# Altium project adio.PRJPCB
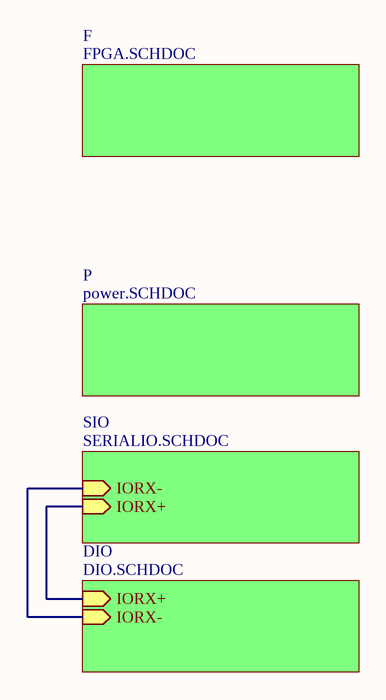
[diagram p0: main.SCHDOC]
6 sheets, 163 parts. Net scope: hierarchical (ports join the sheet entries above them; power ports are global).
Board file: adio.PCBDOC
Sheets:
  main.SCHDOC
    F = FPGA.SCHDOC
      A1 = ADIO.SCHDOC
      A2 = ADIO.SCHDOC
    P = power.SCHDOC
    SIO = SERIALIO.SCHDOC
    DIO = DIO.SCHDOC

## Sheet main.SCHDOC
size A

### Sub-sheets
DIO = DIO.SCHDOC: IORX+ (in), IORX- (in)
F = FPGA.SCHDOC: no entries
P = power.SCHDOC: no entries
SIO = SERIALIO.SCHDOC: IORX- (in), IORX+ (in)

### Nets
IORX+: sheet SIO/IORX+, sheet DIO/IORX+
IORX-: sheet SIO/IORX-, sheet DIO/IORX-

## Sheet FPGA.SCHDOC
size B
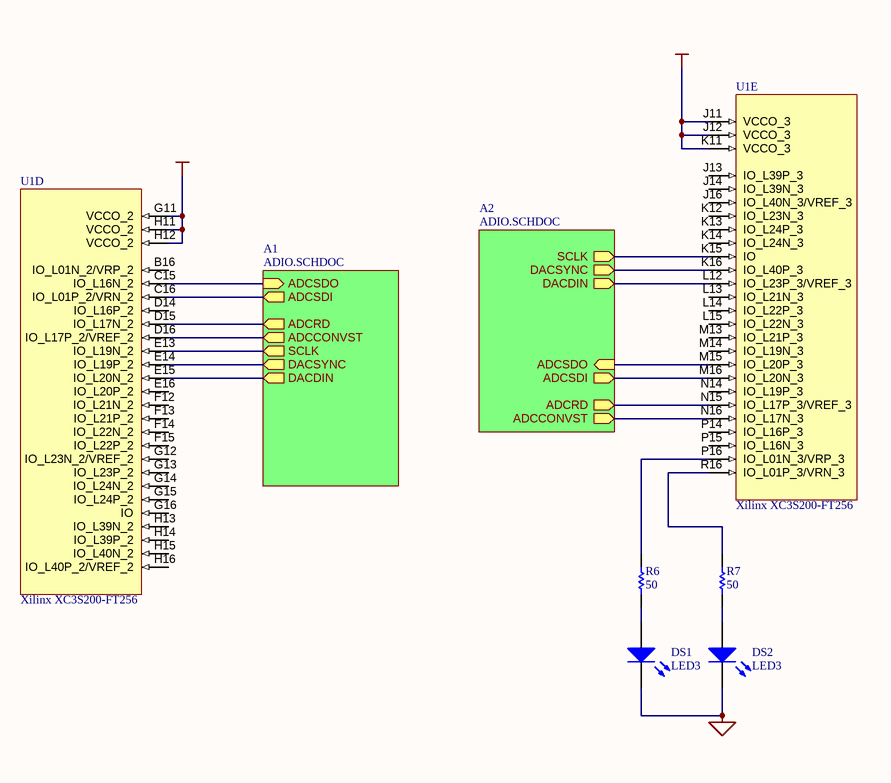
[diagram p1: FPGA.SCHDOC]

### Parts
DS1  LED3  [SMD _LED]
DS2  LED3  [SMD _LED]
R6  value 50  [0603]  (hidden comment: current-limiting series res)
R7  value 50  [0603]  (hidden comment: current-limiting series res)
U1  Xilinx XC3S200-FT256  [Xilinx FT256 BGA]  (parts D,E of 9)

### Sub-sheets
A1 = ADIO.SCHDOC: ADCCONVST (out), SCLK (out), DACSYNC (out), DACDIN (out), ADCSDO (in), ADCSDI (out), ADCRD (out)
A2 = ADIO.SCHDOC: ADCCONVST (out), SCLK (out), DACSYNC (out), DACDIN (out), ADCSDO (in), ADCSDI (out), ADCRD (out)

### Nets
GND: DS1.2(K) DS2.2(K)
VCC: U1.G11(VCCO_2) U1.H11(VCCO_2) U1.H12(VCCO_2) U1.J11(VCCO_3) U1.J12(VCCO_3) U1.K11(VCCO_3)
NetDS1_1: DS1.1(A) R6.2
NetDS2_1: DS2.1(A) R7.2
NetR6_1: R6.1 U1.P16(IO_L01N_3/VRP_3)
NetR7_1: R7.1 U1.R16(IO_L01P_3/VRN_3)
NetU1_C15: U1.C15(IO_L16N_2) ; sheet A1/ADCSDO
NetU1_C16: U1.C16(IO_L01P_2/VRN_2) ; sheet A1/ADCSDI
NetU1_D15: U1.D15(IO_L17N_2) ; sheet A1/ADCRD
NetU1_D16: U1.D16(IO_L17P_2/VREF_2) ; sheet A1/ADCCONVST
NetU1_E13: U1.E13(IO_L19N_2) ; sheet A1/SCLK
NetU1_E14: U1.E14(IO_L19P_2) ; sheet A1/DACSYNC
NetU1_E15: U1.E15(IO_L20N_2) ; sheet A1/DACDIN
NetU1_K15: U1.K15(IO) ; sheet A2/SCLK
NetU1_K16: U1.K16(IO_L40P_3) ; sheet A2/DACSYNC
NetU1_L12: U1.L12(IO_L23P_3/VREF_3) ; sheet A2/DACDIN
NetU1_M15: U1.M15(IO_L20P_3) ; sheet A2/ADCSDO
NetU1_M16: U1.M16(IO_L20N_3) ; sheet A2/ADCSDI
NetU1_N15: U1.N15(IO_L17P_3/VREF_3) ; sheet A2/ADCRD
NetU1_N16: U1.N16(IO_L17N_3) ; sheet A2/ADCCONVST

Not connected (* = marked no-connect by the designer): U1 B16(IO_L01N_2/VRP_2) D14(IO_L16P_2) E16(IO_L20P_2) F12(IO_L21N_2) F13(IO_L21P_2) F14(IO_L22N_2) F15(IO_L22P_2) G12(IO_L23N_2/VREF_2) G13(IO_L23P_2) G14(IO_L24N_2) G15(IO_L24P_2) G16(IO) H13(IO_L39N_2) H14(IO_L39P_2) H15(IO_L40N_2) H16(IO_L40P_2/VREF_2) J13(IO_L39P_3) J14(IO_L39N_3) J16(IO_L40N_3/VREF_3) K12(IO_L23N_3) K13(IO_L24P_3) K14(IO_L24N_3) L13(IO_L21N_3) L14(IO_L22P_3) L15(IO_L22N_3) M13(IO_L21P_3) M14(IO_L19N_3) N14(IO_L19P_3) P14(IO_L16P_3) P15(IO_L16N_3)

### Notes on the sheet
- Title:
- Engineer:
- Date:
- Revision:
- Sheet
- of
- File:

### Library data of the parts
DS1 DS2 = LED3: Typical BLUE SiC LED; Published: 8-Jun-2000; LatestRevisionDate: 17-Dec-2003; LatestRevisionNote: PCB Footprint replaced.; Publisher: Altium Limited
R6 R7 = RESISTOR: Standard Passive Resistor
U1 = XC3S200-FT256: Xilinx Spartan-3 FPGA

## Sheet ADIO.SCHDOC
size B
Used 2 times, as channels F/A1, F/A2. Parts and nets are listed once, with the designators drawn on the sheet.
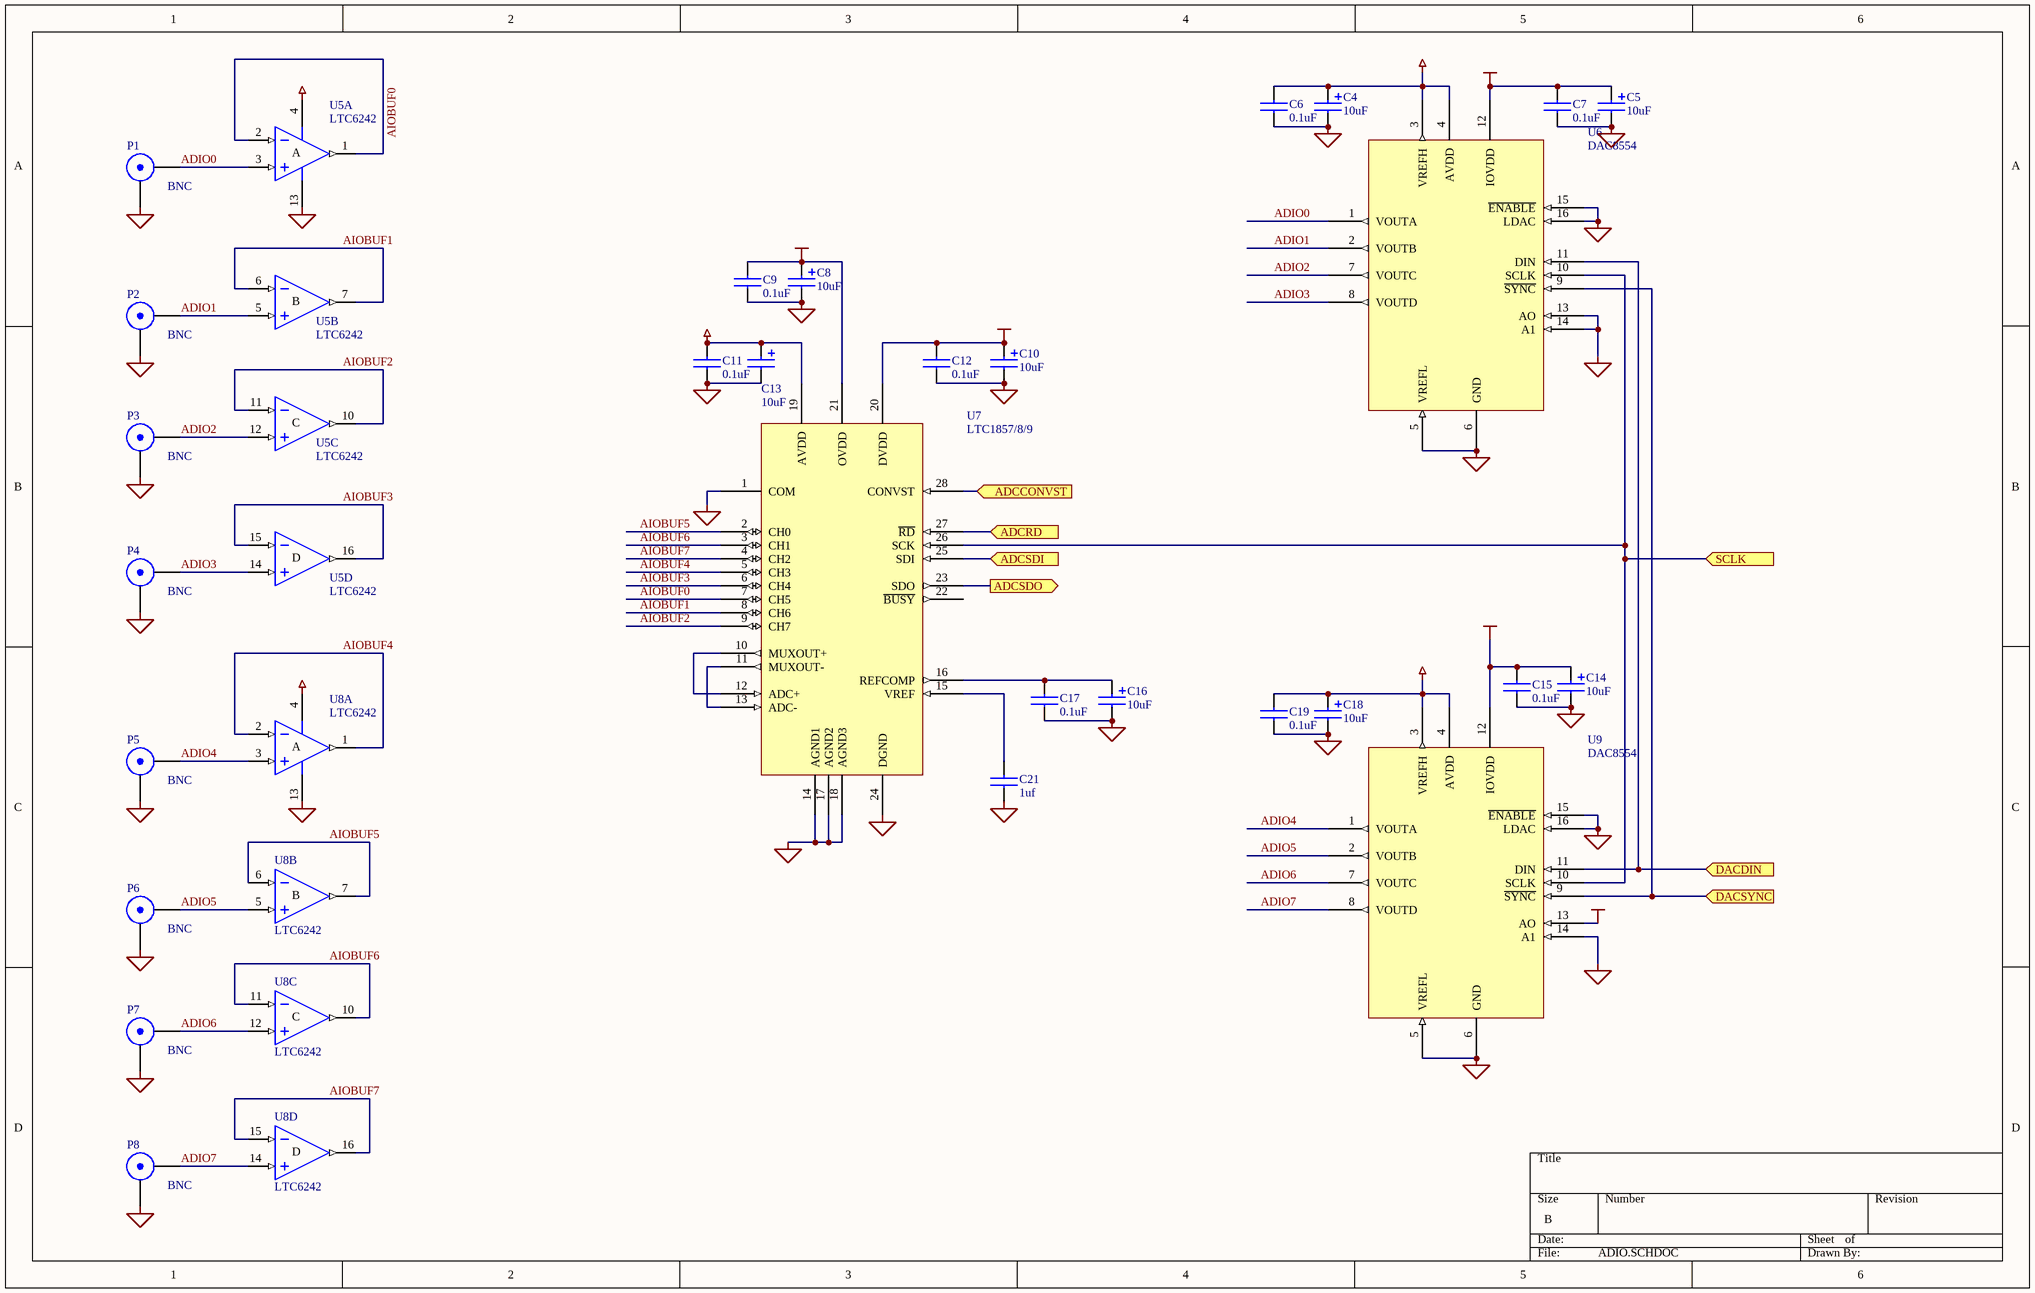
[diagram p2: ADIO.SCHDOC]

### Parts
C4  value 10uF  [3216]  (hidden comment: POLCAP)
C5  value 10uF  [3216]  (hidden comment: POLCAP)
C6  value 0.1uF  [0603]  (hidden comment: CAPACITOR)
C7  value 0.1uF  [0603]  (hidden comment: CAPACITOR)
C8  value 10uF  [3216]  (hidden comment: POLCAP)
C9  value 0.1uF  [0603]  (hidden comment: CAPACITOR)
C10  value 10uF  [3216]  (hidden comment: POLCAP)
C11  value 0.1uF  [0603]  (hidden comment: CAPACITOR)
C12  value 0.1uF  [0603]  (hidden comment: CAPACITOR)
C13  value 10uF  [3216]  (hidden comment: POLCAP)
C14  value 10uF  [3216]  (hidden comment: POLCAP)
C15  value 0.1uF  [0603]  (hidden comment: CAPACITOR)
C16  value 10uF  [3216]  (hidden comment: POLCAP)
C17  value 0.1uF  [0603]  (hidden comment: CAPACITOR)
C18  value 10uF  [3216]  (hidden comment: POLCAP)
C19  value 0.1uF  [0603]  (hidden comment: CAPACITOR)
C21  value 1uf  [0603]  (hidden comment: CAPACITOR)
P1  BNC  [Vertical BNC 227699-1]
P2  BNC  [Vertical BNC 227699-1]
P3  BNC  [Vertical BNC 227699-1]
P4  BNC  [Vertical BNC 227699-1]
P5  BNC  [Vertical BNC 227699-1]
P6  BNC  [Vertical BNC 227699-1]
P7  BNC  [Vertical BNC 227699-1]
P8  BNC  [Vertical BNC 227699-1]
U5  LTC6242  [LTCDHC-16]  (parts A,B,C,D of 4)
U6  DAC8554  [TSSO5x6-G16]
U7  LTC1857/8/9  [LTI_G_TSSOP]
U8  LTC6242  [LTCDHC-16]  (parts A,B,C,D of 4)
U9  DAC8554  [TSSO5x6-G16]

### Ports
ADCCONVST (in), ADCRD (in), ADCSDI (in), ADCSDO (out), DACDIN (in), DACSYNC (in), SCLK (in)

### Nets
+5VCC: C10.1 C12.1 U7.20(DVDD)
AVDD: C4.1 C6.1 C11.1 C13.1 C18.1 C19.1 U5.4(V+) U6.3(VREFH) U6.4(AVDD) U7.19(AVDD) U8.4(V+) U9.3(VREFH) U9.4(AVDD)
GND: C4.2 C5.2 C6.2 C7.2 C8.2 C9.2 C10.2 C11.2 C12.2 C13.2 C14.2 C15.2 C16.2 C17.2 C18.2 C19.2 C21.2 P1.2(Y) P2.2(Y) P3.2(Y) P4.2(Y) P5.2(Y) P6.2(Y) P7.2(Y) P8.2(Y) U5.13(V-) U6.5(VREFL) U6.6(GND) U6.13(AO) U6.14(A1) U6.15(~{ENABLE}) U6.16(LDAC) U7.1(COM) U7.14(AGND1) U7.17(AGND2) U7.18(AGND3) U7.24(DGND) U8.13(V-) U9.5(VREFL) U9.6(GND) U9.14(A1) U9.15(~{ENABLE}) U9.16(LDAC)
VCC: C5.1 C7.1 C8.1 C9.1 C14.1 C15.1 U6.12(IOVDD) U7.21(OVDD) U9.12(IOVDD) U9.13(AO)
ADCCONVST: U7.28(CONVST) ; port ADCCONVST
ADCRD: U7.27(~{RD}) ; port ADCRD
ADCSDI: U7.25(SDI) ; port ADCSDI
ADCSDO: U7.23(SDO) ; port ADCSDO
ADIO0: P1.1(X) U5.3(IN+) U6.1(VOUTA)
ADIO1: P2.1(X) U5.5(IN+) U6.2(VOUTB)
ADIO2: P3.1(X) U5.12(IN+) U6.7(VOUTC)
ADIO3: P4.1(X) U5.14(IN+) U6.8(VOUTD)
ADIO4: P5.1(X) U8.3(IN+) U9.1(VOUTA)
ADIO5: P6.1(X) U8.5(IN+) U9.2(VOUTB)
ADIO6: P7.1(X) U8.12(IN+) U9.7(VOUTC)
ADIO7: P8.1(X) U8.14(IN+) U9.8(VOUTD)
AIOBUF0: U5.1(OUT) U5.2(IN-) U7.7(CH5)
AIOBUF1: U5.6(IN-) U5.7(OUT) U7.8(CH6)
AIOBUF2: U5.10(OUT) U5.11(IN-) U7.9(CH7)
AIOBUF3: U5.15(IN-) U5.16(OUT) U7.6(CH4)
AIOBUF4: U7.5(CH3) U8.1(OUT) U8.2(IN-)
AIOBUF5: U7.2(CH0) U8.6(IN-) U8.7(OUT)
AIOBUF6: U7.3(CH1) U8.10(OUT) U8.11(IN-)
AIOBUF7: U7.4(CH2) U8.15(IN-) U8.16(OUT)
DACDIN: U6.11(DIN) U9.11(DIN) ; port DACDIN
DACSYNC: U6.9(~{SYNC}) U9.9(~{SYNC}) ; port DACSYNC
SCLK: U6.10(SCLK) U7.26(SCK) U9.10(SCLK) ; port SCLK
NetC16_1: C16.1 C17.1 U7.16(REFCOMP)
NetC21_1: C21.1 U7.15(VREF)
NetU7_10: U7.10(MUXOUT+) U7.12(ADC+)
NetU7_11: U7.11(MUXOUT-) U7.13(ADC-)

Not connected (* = marked no-connect by the designer): U7 22(~{BUSY})

### Channels
F/A1: designators end in .A1; ports ADCCONVST=NetU1_D16 ADCRD=NetU1_D15 ADCSDI=NetU1_C16 ADCSDO=NetU1_C15 DACDIN=NetU1_E15 DACSYNC=NetU1_E14 SCLK=NetU1_E13
F/A2: designators end in .A2; ports ADCCONVST=NetU1_N16 ADCRD=NetU1_N15 ADCSDI=NetU1_M16 ADCSDO=NetU1_M15 DACDIN=NetU1_L12 DACSYNC=NetU1_K16 SCLK=NetU1_K15

### Notes on the sheet
- (in symbol LTC6242, part A) A
- (in symbol LTC6242, part B) B
- (in symbol LTC6242, part C) C
- (in symbol LTC6242, part D) D

### Library data of the parts
C4 C5 C8 C10 C13 C14 C16 C18 = POLCAP: Standard Capacitor; Type: Tantalum
C6 C7 C9 C11 C12 C15 C17 C19 C21 = CAPACITOR: Standard Capacitor; Type: X7R
P1-P8 = BNC: BNC Elbow Connector; Manufacturer: Generic Components; Class II: RF Coaxial; Revision: July-2002: Re-released for DXP Platform.; Publisher: Altium Limited; Class I: Connector
U5 U8 = LTC6242: Quad 18 Mhz, Low Noise, Rail-to-Rail CMOS Op-Amp; Published: 8-Jun-2000; LatestRevisionDate: 6-Jun-2005; DatasheetDocument: 1996; Publisher: Altium Limited
U6 U9 = DAC8554: TI 16-bit quad chan Voltage Output DAC
U7 = LTC1859: LTC 8-channel 12, 14, 16 100ksps ADC

## Sheet power.SCHDOC
size B
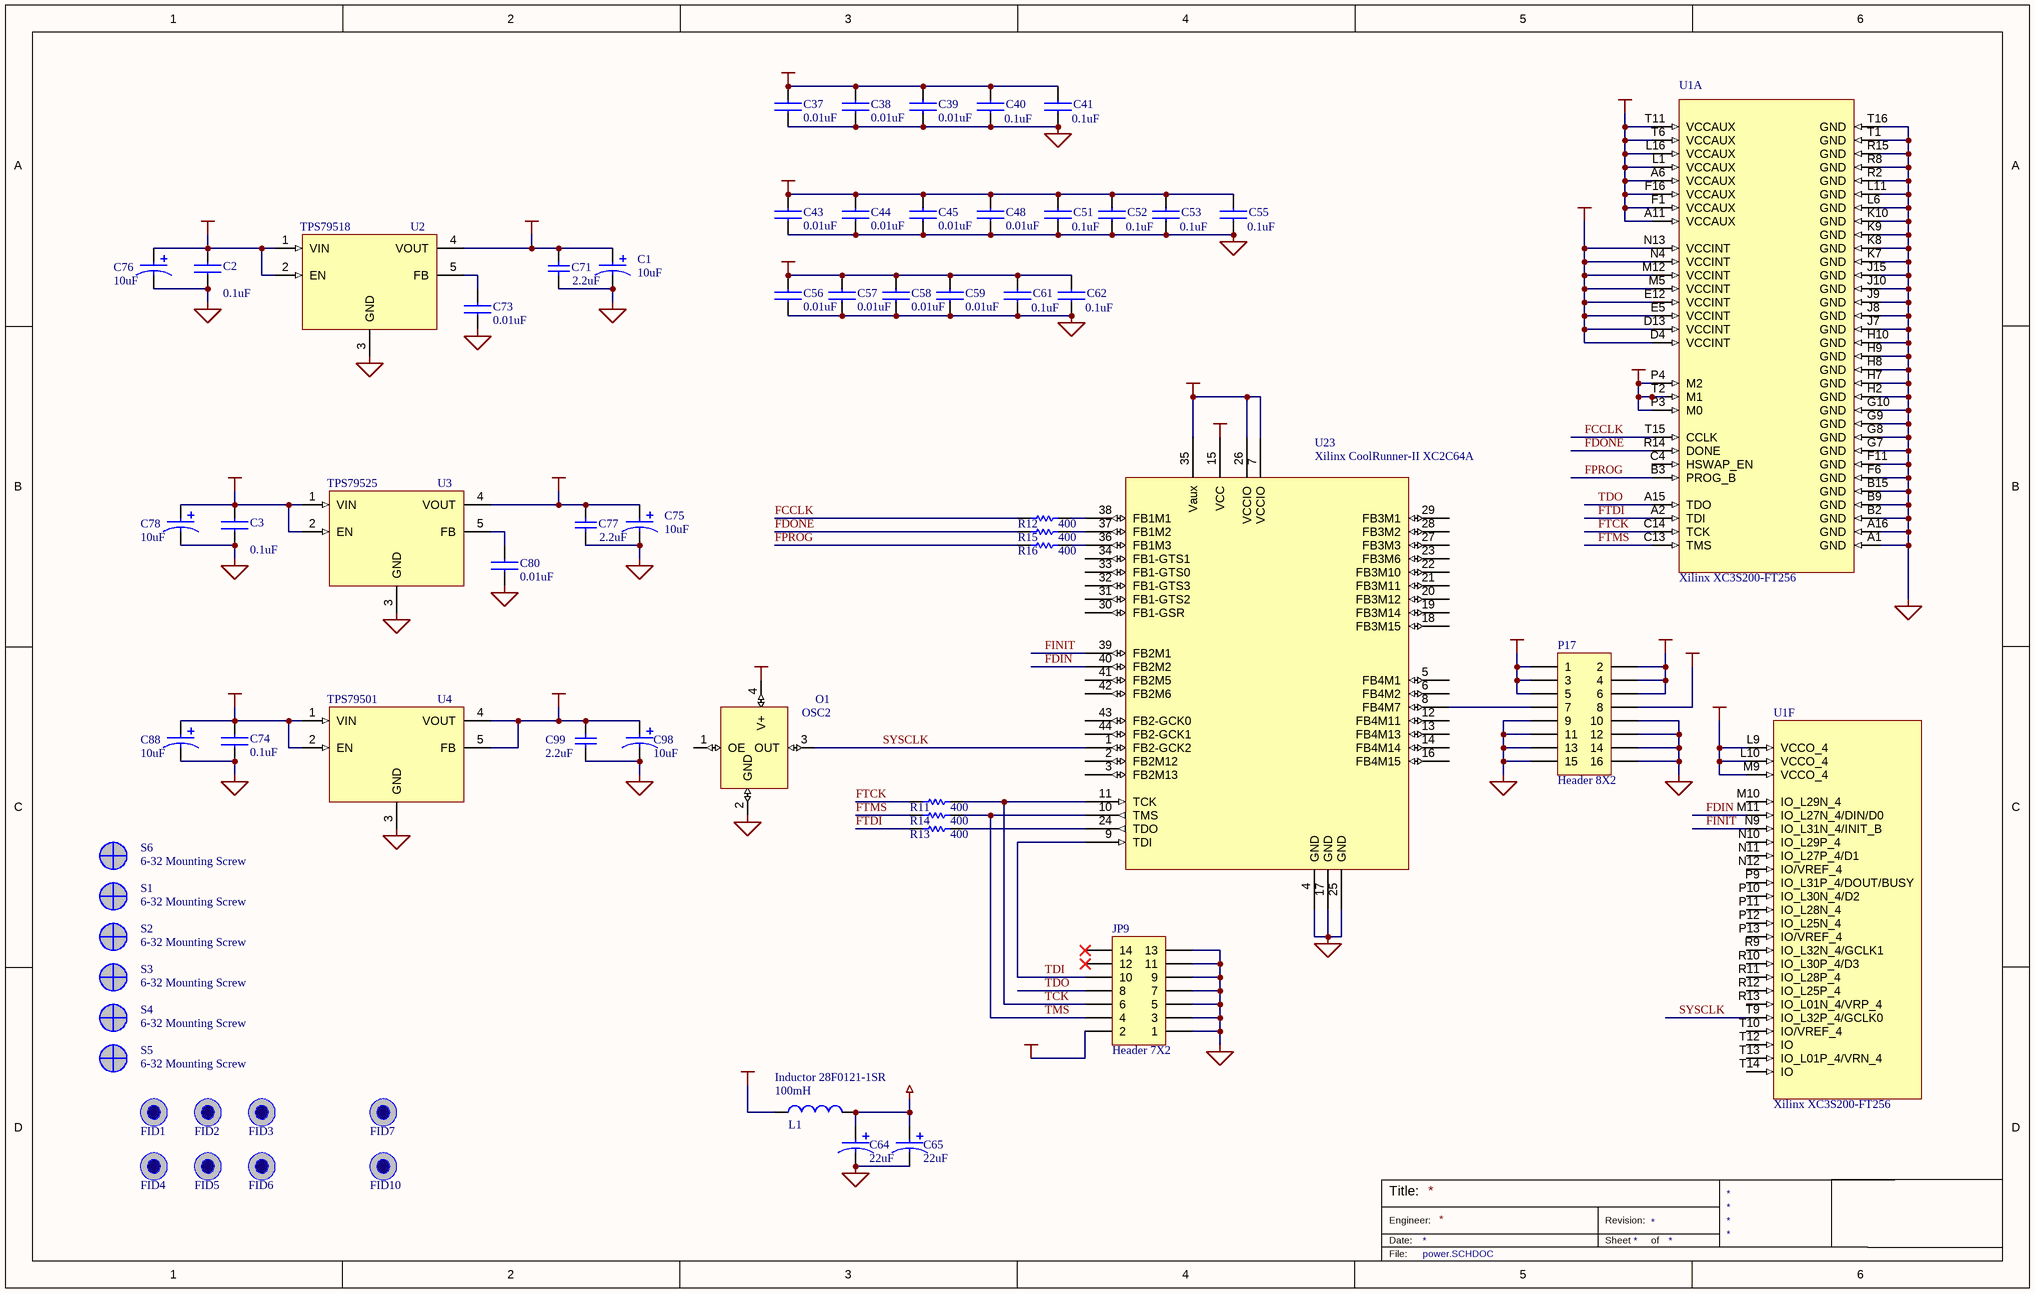
[diagram p3: power.SCHDOC]

### Parts
C1  value 10uF  [6032]  (hidden comment: POLCAP2)
C2  value 0.1uF  [0603]  (hidden comment: CAPACITOR)
C3  value 0.1uF  [0603]  (hidden comment: CAPACITOR)
C37  value 0.01uF  [0402]  (hidden comment: CAPACITOR)
C38  value 0.01uF  [0402]  (hidden comment: CAPACITOR)
C39  value 0.01uF  [0402]  (hidden comment: CAPACITOR)
C40  value 0.1uF  [0603]  (hidden comment: CAPACITOR)
C41  value 0.1uF  [0603]  (hidden comment: CAPACITOR)
C43  value 0.01uF  [0402]  (hidden comment: CAPACITOR)
C44  value 0.01uF  [0402]  (hidden comment: CAPACITOR)
C45  value 0.01uF  [0402]  (hidden comment: CAPACITOR)
C48  value 0.01uF  [0402]  (hidden comment: CAPACITOR)
C51  value 0.1uF  [0603]  (hidden comment: CAPACITOR)
C52  value 0.1uF  [0603]  (hidden comment: CAPACITOR)
C53  value 0.1uF  [0603]  (hidden comment: CAPACITOR)
C55  value 0.1uF  [0603]  (hidden comment: CAPACITOR)
C56  value 0.01uF  [0402]  (hidden comment: CAPACITOR)
C57  value 0.01uF  [0402]  (hidden comment: CAPACITOR)
C58  value 0.01uF  [0402]  (hidden comment: CAPACITOR)
C59  value 0.01uF  [0402]  (hidden comment: CAPACITOR)
C61  value 0.1uF  [0603]  (hidden comment: CAPACITOR)
C62  value 0.1uF  [0603]  (hidden comment: CAPACITOR)
C64  value 22uF  [6032]  (hidden comment: POLCAP2)
C65  value 22uF  [6032]  (hidden comment: POLCAP2)
C71  value 2.2uF  [1206]  (hidden comment: Cap)
C73  value 0.01uF  [0402]  (hidden comment: CAPACITOR)
C74  value 0.1uF  [0603]  (hidden comment: CAPACITOR)
C75  value 10uF  [6032]  (hidden comment: POLCAP2)
C76  value 10uF  [6032]  (hidden comment: POLCAP2)
C77  value 2.2uF  [1206]  (hidden comment: Cap)
C78  value 10uF  [6032]  (hidden comment: POLCAP2)
C80  value 0.01uF  [0402]  (hidden comment: CAPACITOR)
C88  value 10uF  [6032]  (hidden comment: POLCAP2)
C98  value 10uF  [6032]  (hidden comment: POLCAP2)
C99  value 2.2uF  [1206]  (hidden comment: Cap)
FID1  FIDUCIAL  [FIDUCIAL]  (value not drawn)
FID2  FIDUCIAL  [FIDUCIAL]  (value not drawn)
FID3  FIDUCIAL  [FIDUCIAL]  (value not drawn)
FID4  FIDUCIAL  [FIDUCIAL]  (value not drawn)
FID5  FIDUCIAL  [FIDUCIAL]  (value not drawn)
FID6  FIDUCIAL  [FIDUCIAL]  (value not drawn)
FID7  FIDUCIAL  [FIDUCIAL]  (value not drawn)
FID10  FIDUCIAL  [FIDUCIAL]  (value not drawn)
JP9  Header 7X2  [SMT 2x7 2mm HDR]
L1  Inductor 28F0121-1SR  value 100mH  [STEWARD_1SR]
O1  OSC2  [ECS-3953M]
P17  Header 8X2  [MOLEX 15-91-2160]
R11  value 400  [0603]  (hidden comment: current-limiting series res)
R12  value 400  [0603]  (hidden comment: current-limiting series res)
R13  value 400  [0603]  (hidden comment: current-limiting series res)
R14  value 400  [0603]  (hidden comment: current-limiting series res)
R15  value 400  [0603]  (hidden comment: current-limiting series res)
R16  value 400  [0603]  (hidden comment: current-limiting series res)
S1  6-32 Mounting Screw  [SCREW6-32]
S2  6-32 Mounting Screw  [SCREW6-32]
S3  6-32 Mounting Screw  [SCREW6-32]
S4  6-32 Mounting Screw  [SCREW6-32]
S5  6-32 Mounting Screw  [SCREW6-32]
S6  6-32 Mounting Screw  [SCREW6-32]
U1  Xilinx XC3S200-FT256  [Xilinx FT256 BGA]  (parts A,F of 9)
U2  TPS79518  [SOT223-5/Simple]
U3  TPS79525  [SOT223-5/Simple]
U4  TPS79501  [SOT223-5/Simple]
U23  Xilinx CoolRunner-II XC2C64A  [QFP10x10-G44/G10N]

### Nets
+1.2VCC: C37.1 C38.1 C39.1 C40.1 C41.1 C98.1 C99.2 U1.D4(VCCINT) U1.D13(VCCINT) U1.E5(VCCINT) U1.E12(VCCINT) U1.M5(VCCINT) U1.M12(VCCINT) U1.N4(VCCINT) U1.N13(VCCINT) U4.4(VOUT) U4.5(FB)
+1.8VCC: C1.1 C71.2 U2.4(VOUT) U23.15(VCC)
+2.5VCC: C43.1 C44.1 C45.1 C48.1 C51.1 C52.1 C53.1 C55.1 C75.1 C77.2 U1.A6(VCCAUX) U1.A11(VCCAUX) U1.F1(VCCAUX) U1.F16(VCCAUX) U1.L1(VCCAUX) U1.L16(VCCAUX) U1.T6(VCCAUX) U1.T11(VCCAUX) U3.4(VOUT)
+5VCC: L1.1 P17.2 P17.4 P17.6
+12VCC: P17.8
AVDD: C64.1 C65.1 L1.2
GND: C1.2 C2.1 C3.1 C37.2 C38.2 C39.2 C40.2 C41.2 C43.2 C44.2 C45.2 C48.2 C51.2 C52.2 C53.2 C55.2 C56.2 C57.2 C58.2 C59.2 C61.2 C62.2 C64.2 C65.2 C71.1 C73.1 C74.1 C75.2 C76.2 C77.1 C78.2 C80.1 C88.2 C98.2 C99.1 JP9.1 JP9.3 JP9.5 JP9.7 JP9.9 JP9.11 JP9.13 O1.2(GND) P17.9 P17.10 P17.11 P17.12 P17.13 P17.14 P17.15 P17.16 U1.A1(GND) U1.A16(GND) U1.B2(GND) U1.B9(GND) U1.B15(GND) U1.F6(GND) U1.F11(GND) U1.G7(GND) U1.G8(GND) U1.G9(GND) U1.G10(GND) U1.H2(GND) U1.H7(GND) U1.H8(GND) U1.H9(GND) U1.H10(GND) U1.J7(GND) U1.J8(GND) U1.J9(GND) U1.J10(GND) U1.J15(GND) U1.K7(GND) U1.K8(GND) U1.K9(GND) U1.K10(GND) U1.L6(GND) U1.L11(GND) U1.R2(GND) U1.R8(GND) U1.R15(GND) U1.T1(GND) U1.T16(GND) U2.3(GND) U3.3(GND) U4.3(GND) U23.4(GND) U23.17(GND) U23.25(GND)
VCC: C2.2 C3.2 C56.1 C57.1 C58.1 C59.1 C61.1 C62.1 C74.2 C76.1 C78.1 C88.1 JP9.2 O1.4(V+) P17.1 P17.3 P17.5 U1.L9(VCCO_4) U1.L10(VCCO_4) U1.M9(VCCO_4) U1.P3(M0) U1.P4(M2) U1.T2(M1) U2.1(VIN) U2.2(EN) U3.1(VIN) U3.2(EN) U4.1(VIN) U4.2(EN) U23.7(VCCIO) U23.26(VCCIO) U23.35(Vaux)
FCCLK: R12.2 U1.T15(CCLK)
FDIN: U1.M11(IO_L27N_4/DIN/D0) U23.40(FB2M2)
FDONE: R15.2 U1.R14(DONE)
FINIT: U1.N9(IO_L31N_4/INIT_B) U23.39(FB2M1)
FPROG: R16.2 U1.B3(PROG_B)
FTCK: R11.2 U1.C14(TCK)
FTDI: R13.2 U1.A2(TDI)
FTMS: R14.1 U1.C13(TMS)
SYSCLK: O1.3(OUT) U1.T9(IO_L32P_4/GCLK0) U23.1(FB2-GCK2)
TCK: JP9.6 R11.1 U23.11(TCK)
TDI: JP9.10 U23.9(TDI)
TDO: JP9.8 U1.A15(TDO)
TMS: JP9.4 R14.2 U23.10(TMS)
NetC73_2: C73.2 U2.5(FB)
NetC80_2: C80.2 U3.5(FB)
NetP17_7: P17.7 U23.8(FB4M7)
NetR12_1: R12.1 U23.38(FB1M1)
NetR13_1: R13.1 U23.24(TDO)
NetR15_1: R15.1 U23.37(FB1M2)
NetR16_1: R16.1 U23.36(FB1M3)

Not connected (* = marked no-connect by the designer): JP9 12* 14*; O1 1(OE); U1 C4(HSWAP_EN) M10(IO_L29N_4) N10(IO_L29P_4) N11(IO_L27P_4/D1) N12(IO/VREF_4) P9(IO_L31P_4/DOUT/BUSY) P10(IO_L30N_4/D2) P11(IO_L28N_4) P12(IO_L25N_4) P13(IO/VREF_4) R9(IO_L32N_4/GCLK1) R10(IO_L30P_4/D3) R11(IO_L28P_4) R12(IO_L25P_4) R13(IO_L01N_4/VRP_4) T10(IO/VREF_4) T12(IO) T13(IO_L01P_4/VRN_4) T14(IO); U23 2(FB2M12) 3(FB2M13) 5(FB4M1) 6(FB4M2) 12(FB4M11) 13(FB4M13) 14(FB4M14) 16(FB4M15) 18(FB3M15) 19(FB3M14) 20(FB3M12) 21(FB3M11) 22(FB3M10) 23(FB3M6) 27(FB3M3) 28(FB3M2) 29(FB3M1) 30(FB1-GSR) 31(FB1-GTS2) 32(FB1-GTS3) 33(FB1-GTS0) 34(FB1-GTS1) 41(FB2M5) 42(FB2M6) 43(FB2-GCK0) 44(FB2-GCK1)

### Notes on the sheet
- Title:
- Engineer:
- Date:
- Revision:
- Sheet
- of
- File:

### Library data of the parts
C1 C64 C65 C75 C76 C78 C88 C98 = POLCAP2: Standard Capacitor
C2 C3 C73 C74 C80 = CAPACITOR: Standard Capacitor
C37-C41 C43-C45 C48 C51-C53 C55-C59 C61 C62 = CAPACITOR: Standard Capacitor; Type: X7R
C71 C77 C99 = Cap: Capacitor; Manufacturer: Generic Components; Class I: Passive; Published: 8-Jun-2000; Revision: July-2002: Re-released for DXP Platform.; Publisher: Altium Limited; Class II: Capacitor
JP9 = Header 7X2: Header, 7-Pin, Dual row; Manufacturer: Generic Components; Class I: Connector; Revision: July-2002: Re-released for DXP Platform.; Publisher: Altium Limited
L1 = Inductor: Manufacturer: Generic Components; Class I: Passive; Published: 8-Jun-2000; Revision: July-2002: Re-released for DXP Platform.; Publisher: Altium Limited; Class II: Inductor
O1 = OSC2: ECS SMD Oscillator, ECS-3953M
P17 = Header 8X2: Header, 8-Pin, Dual row; LatestRevisionDate: 17-Jul-2002; LatestRevisionNote: Re-released for DXP Platform.; Publisher: Altium Limited
R11-R16 = RESISTOR: Standard Passive Resistor
S1-S6 = MNTSCREW
U1 = XC3S200-FT256: Xilinx Spartan-3 FPGA
U2-U4 = TPS795XX: TI Ultra-low-noise LDO
U23 = XC2C64A-5VQ44C

## Sheet SERIALIO.SCHDOC
size B
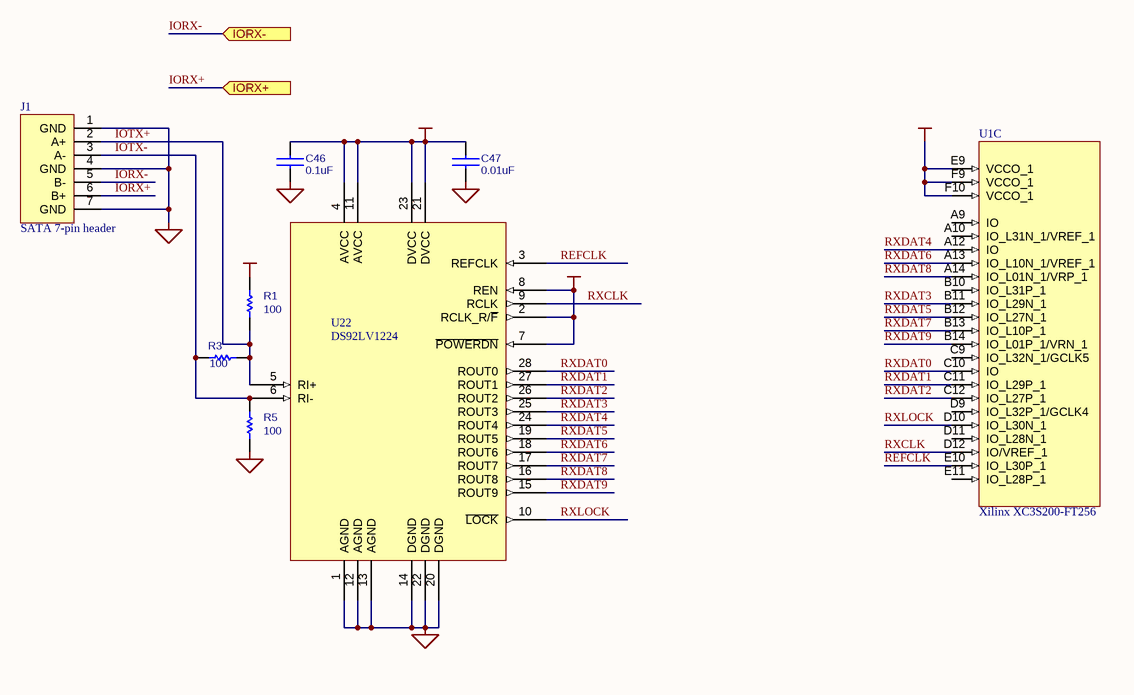
[diagram p4: SERIALIO.SCHDOC]

### Parts
C46  value 0.1uF  [0603]  (hidden comment: CAPACITOR)
C47  value 0.01uF  [0402]  (hidden comment: CAPACITOR)
J1  SATA 7-pin header  [MOLES 67800-5005]
R1  100  [0603]
R3  100  [0603]
R5  100  [0603]
U1  Xilinx XC3S200-FT256  [Xilinx FT256 BGA]  (part C of 9)
U22  DS92LV1224  [SSO-G28/E4.3]

### Ports
IORX+ (in), IORX- (in)

### Nets
GND: C46.1 C47.1 J1.1(GND) J1.4(GND) J1.7(GND) R5.1 U22.1(AGND) U22.12(AGND) U22.13(AGND) U22.14(DGND) U22.20(DGND) U22.22(DGND)
VCC: C46.2 C47.2 R1.1 U1.E9(VCCO_1) U1.F9(VCCO_1) U1.F10(VCCO_1) U22.2(RCLK_R/~{F}) U22.4(AVCC) U22.7(~{POWERDN}) U22.8(REN) U22.11(AVCC) U22.21(DVCC) U22.23(DVCC)
IORX+: J1.6(B+) ; port IORX+
IORX-: J1.5(B-) ; port IORX-
IOTX+: J1.2(A+) R1.2 R3.2 U22.5(RI+)
IOTX-: J1.3(A-) R3.1 R5.2 U22.6(RI-)
REFCLK: U1.E10(IO_L30P_1) U22.3(REFCLK)
RXCLK: U1.D12(IO/VREF_1) U22.9(RCLK)
RXDAT0: U1.C10(IO) U22.28(ROUT0)
RXDAT1: U1.C11(IO_L29P_1) U22.27(ROUT1)
RXDAT2: U1.C12(IO_L27P_1) U22.26(ROUT2)
RXDAT3: U1.B11(IO_L29N_1) U22.25(ROUT3)
RXDAT4: U1.A12(IO) U22.24(ROUT4)
RXDAT5: U1.B12(IO_L27N_1) U22.19(ROUT5)
RXDAT6: U1.A13(IO_L10N_1/VREF_1) U22.18(ROUT6)
RXDAT7: U1.B13(IO_L10P_1) U22.17(ROUT7)
RXDAT8: U1.A14(IO_L01N_1/VRP_1) U22.16(ROUT8)
RXDAT9: U1.B14(IO_L01P_1/VRN_1) U22.15(ROUT9)
RXLOCK: U1.D10(IO_L30N_1) U22.10(~{LOCK})

Not connected (* = marked no-connect by the designer): U1 A9(IO) A10(IO_L31N_1/VREF_1) B10(IO_L31P_1) C9(IO_L32N_1/GCLK5) D9(IO_L32P_1/GCLK4) D11(IO_L28N_1) E11(IO_L28P_1)

### Notes on the sheet
- Title:
- Engineer:
- Date:
- Revision:
- Sheet
- of
- File:

### Library data of the parts
C46 C47 = CAPACITOR: Standard Capacitor
J1 = SATA-7
R1 R3 R5 = RESISTOR: Standard Passive Resistor; Value: 100
U1 = XC3S200-FT256: Xilinx Spartan-3 FPGA
U22 = DS92LV1224: 30-66 MHz 10-Bit Bus LVDS Deserializer

## Sheet DIO.SCHDOC
size B
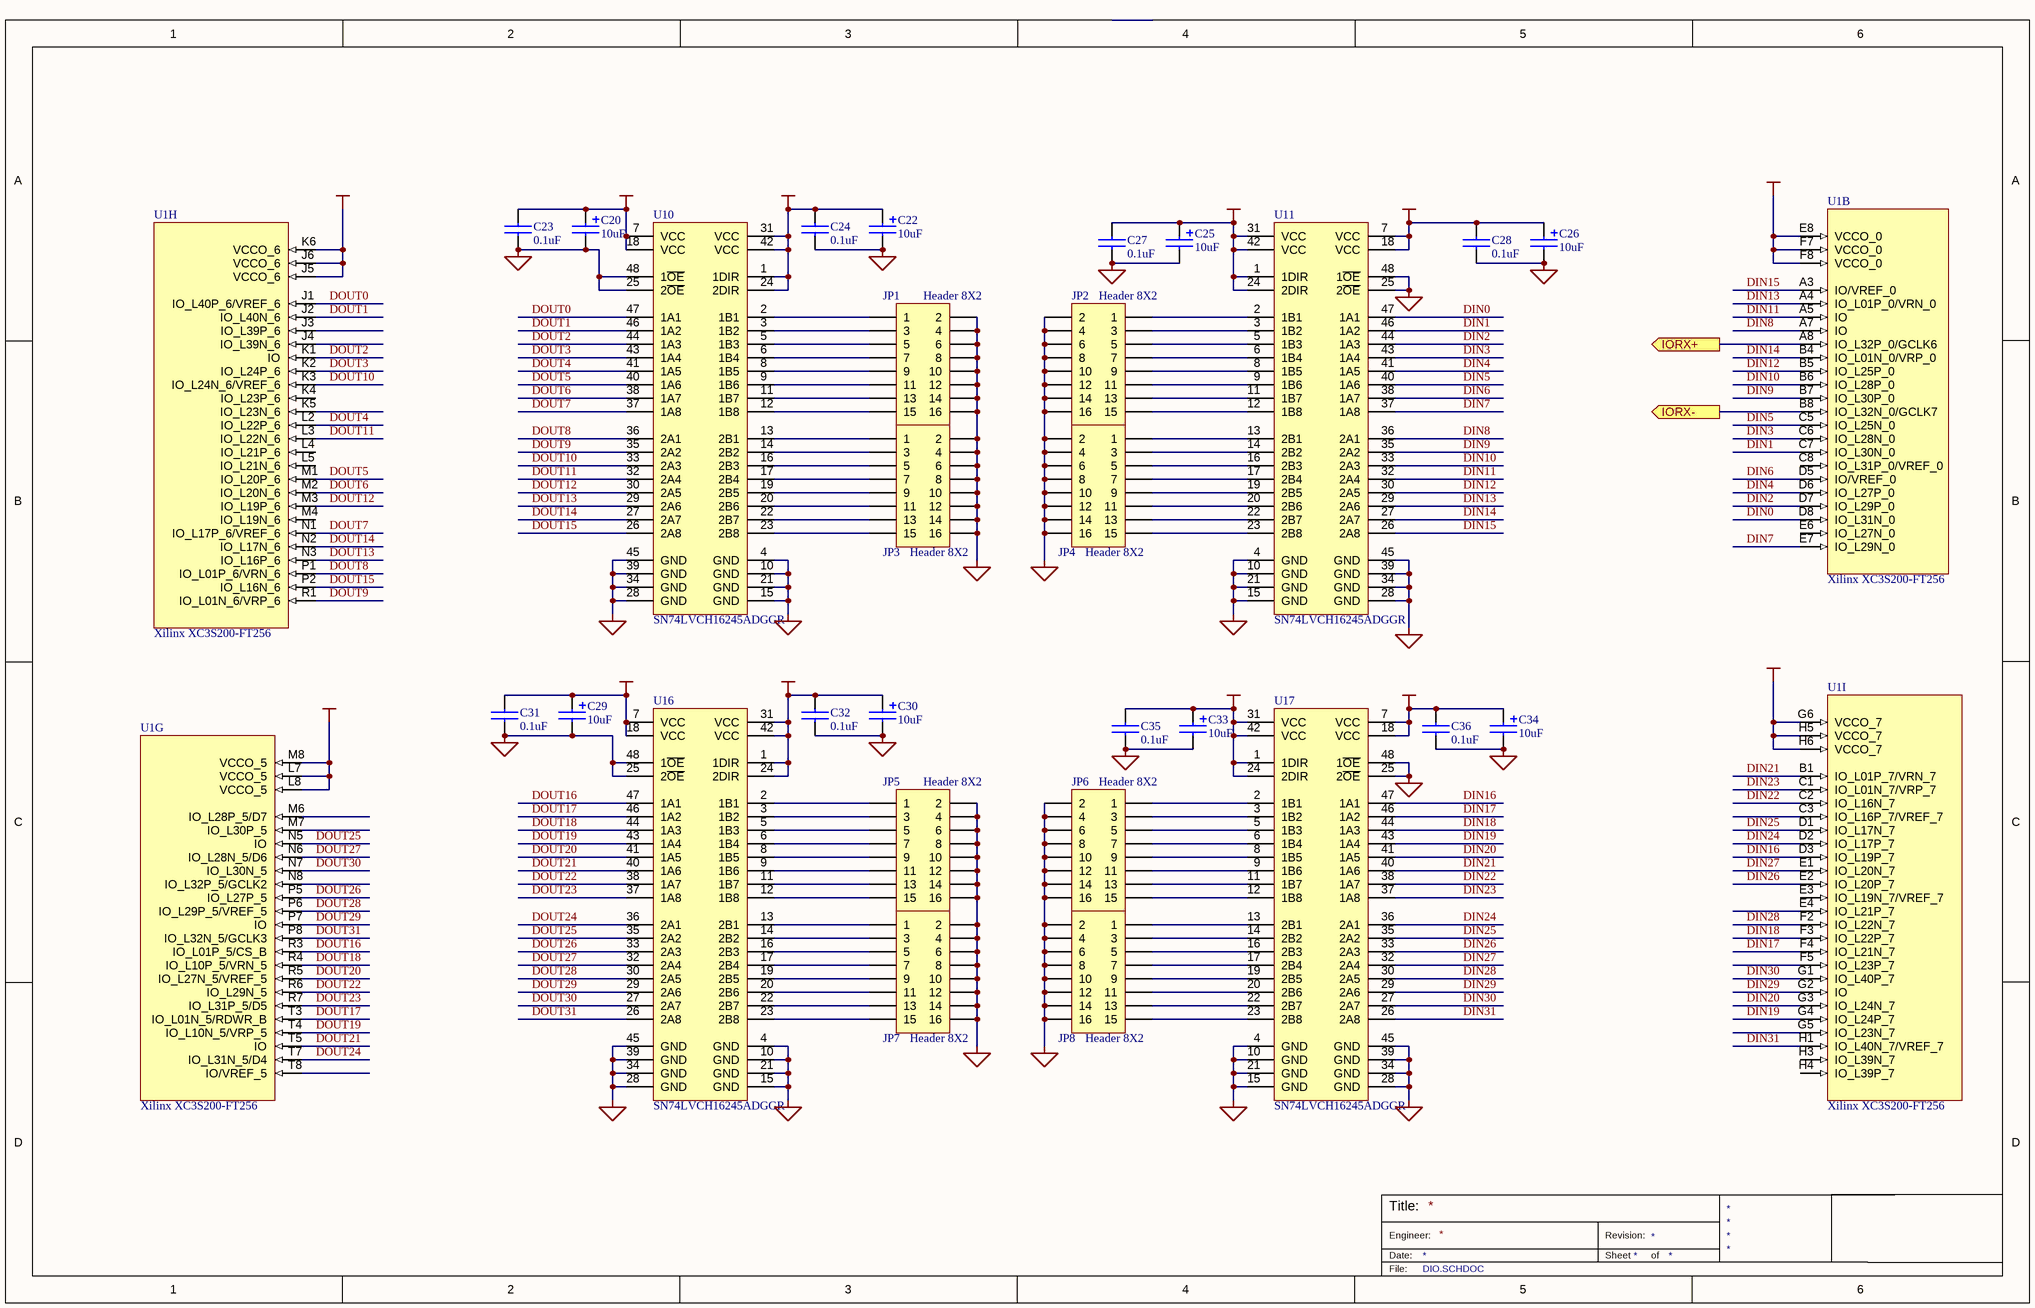
[diagram p5: DIO.SCHDOC]

### Parts
C20  value 10uF  [3216]  (hidden comment: POLCAP)
C22  value 10uF  [3216]  (hidden comment: POLCAP)
C23  value 0.1uF  [0603]  (hidden comment: CAPACITOR)
C24  value 0.1uF  [0603]  (hidden comment: CAPACITOR)
C25  value 10uF  [3216]  (hidden comment: POLCAP)
C26  value 10uF  [3216]  (hidden comment: POLCAP)
C27  value 0.1uF  [0603]  (hidden comment: CAPACITOR)
C28  value 0.1uF  [0603]  (hidden comment: CAPACITOR)
C29  value 10uF  [3216]  (hidden comment: POLCAP)
C30  value 10uF  [3216]  (hidden comment: POLCAP)
C31  value 0.1uF  [0603]  (hidden comment: CAPACITOR)
C32  value 0.1uF  [0603]  (hidden comment: CAPACITOR)
C33  value 10uF  [3216]  (hidden comment: POLCAP)
C34  value 10uF  [3216]  (hidden comment: POLCAP)
C35  value 0.1uF  [0603]  (hidden comment: CAPACITOR)
C36  value 0.1uF  [0603]  (hidden comment: CAPACITOR)
JP1  Header 8X2  [HDR2X8]
JP2  Header 8X2  [HDR2X8]
JP3  Header 8X2  [HDR2X8]
JP4  Header 8X2  [HDR2X8]
JP5  Header 8X2  [HDR2X8]
JP6  Header 8X2  [HDR2X8]
JP7  Header 8X2  [HDR2X8]
JP8  Header 8X2  [HDR2X8]
U1  Xilinx XC3S200-FT256  [Xilinx FT256 BGA]  (parts B,G,H,I of 9)
U10  SN74LVCH16245ADGGR  [TSSO12x8-G48/X.3]
U11  SN74LVCH16245ADGGR  [TSSO12x8-G48/X.3]
U16  SN74LVCH16245ADGGR  [TSSO12x8-G48/X.3]
U17  SN74LVCH16245ADGGR  [TSSO12x8-G48/X.3]

### Ports
IORX+ (out), IORX- (out)

### Nets
+2.5VCC: C22.1 C24.1 C25.1 C27.1 C30.1 C32.1 C33.1 C35.1 U1.E8(VCCO_0) U1.F7(VCCO_0) U1.F8(VCCO_0) U1.G6(VCCO_7) U1.H5(VCCO_7) U1.H6(VCCO_7) U1.J5(VCCO_6) U1.J6(VCCO_6) U1.K6(VCCO_6) U1.L7(VCCO_5) U1.L8(VCCO_5) U1.M8(VCCO_5) U10.1(1DIR) U10.24(2DIR) U10.31(VCC) U10.42(VCC) U11.1(1DIR) U11.24(2DIR) U11.31(VCC) U11.42(VCC) U16.1(1DIR) U16.24(2DIR) U16.31(VCC) U16.42(VCC) U17.1(1DIR) U17.24(2DIR) U17.31(VCC) U17.42(VCC)
+5VCC: C20.1 C23.1 C26.1 C28.1 C29.1 C31.1 C34.1 C36.1 U10.7(VCC) U10.18(VCC) U11.7(VCC) U11.18(VCC) U16.7(VCC) U16.18(VCC) U17.7(VCC) U17.18(VCC)
GND: C20.2 C22.2 C23.2 C24.2 C25.2 C26.2 C27.2 C28.2 C29.2 C30.2 C31.2 C32.2 C33.2 C34.2 C35.2 C36.2 JP1.2 JP1.4 JP1.6 JP1.8 JP1.10 JP1.12 JP1.14 JP1.16 JP2.2 JP2.4 JP2.6 JP2.8 JP2.10 JP2.12 JP2.14 JP2.16 JP3.2 JP3.4 JP3.6 JP3.8 JP3.10 JP3.12 JP3.14 JP3.16 JP4.2 JP4.4 JP4.6 JP4.8 JP4.10 JP4.12 JP4.14 JP4.16 JP5.2 JP5.4 JP5.6 JP5.8 JP5.10 JP5.12 JP5.14 JP5.16 JP6.2 JP6.4 JP6.6 JP6.8 JP6.10 JP6.12 JP6.14 JP6.16 JP7.2 JP7.4 JP7.6 JP7.8 JP7.10 JP7.12 JP7.14 JP7.16 JP8.2 JP8.4 JP8.6 JP8.8 JP8.10 JP8.12 JP8.14 JP8.16 U10.4(GND) U10.10(GND) U10.15(GND) U10.21(GND) U10.25(2~{OE}) U10.28(GND) U10.34(GND) U10.39(GND) U10.45(GND) U10.48(1~{OE}) U11.4(GND) U11.10(GND) U11.15(GND) U11.21(GND) U11.25(2~{OE}) U11.28(GND) U11.34(GND) U11.39(GND) U11.45(GND) U11.48(1~{OE}) U16.4(GND) U16.10(GND) U16.15(GND) U16.21(GND) U16.25(2~{OE}) U16.28(GND) U16.34(GND) U16.39(GND) U16.45(GND) U16.48(1~{OE}) U17.4(GND) U17.10(GND) U17.15(GND) U17.21(GND) U17.25(2~{OE}) U17.28(GND) U17.34(GND) U17.39(GND) U17.45(GND) U17.48(1~{OE})
DIN0: U1.D8(IO_L31N_0) U11.47(1A1)
DIN1: U1.C7(IO_L30N_0) U11.46(1A2)
DIN2: U1.D7(IO_L29P_0) U11.44(1A3)
DIN3: U1.C6(IO_L28N_0) U11.43(1A4)
DIN4: U1.D6(IO_L27P_0) U11.41(1A5)
DIN5: U1.C5(IO_L25N_0) U11.40(1A6)
DIN6: U1.D5(IO/VREF_0) U11.38(1A7)
DIN7: U1.E7(IO_L29N_0) U11.37(1A8)
DIN8: U1.A7(IO) U11.36(2A1)
DIN9: U1.B7(IO_L30P_0) U11.35(2A2)
DIN10: U1.B6(IO_L28P_0) U11.33(2A3)
DIN11: U1.A5(IO) U11.32(2A4)
DIN12: U1.B5(IO_L25P_0) U11.30(2A5)
DIN13: U1.A4(IO_L01P_0/VRN_0) U11.29(2A6)
DIN14: U1.B4(IO_L01N_0/VRP_0) U11.27(2A7)
DIN15: U1.A3(IO/VREF_0) U11.26(2A8)
DIN16: U1.D3(IO_L19P_7) U17.47(1A1)
DIN17: U1.F4(IO_L21N_7) U17.46(1A2)
DIN18: U1.F3(IO_L22P_7) U17.44(1A3)
DIN19: U1.G4(IO_L24P_7) U17.43(1A4)
DIN20: U1.G3(IO_L24N_7) U17.41(1A5)
DIN21: U1.B1(IO_L01P_7/VRN_7) U17.40(1A6)
DIN22: U1.C2(IO_L16N_7) U17.38(1A7)
DIN23: U1.C1(IO_L01N_7/VRP_7) U17.37(1A8)
DIN24: U1.D2(IO_L17P_7) U17.36(2A1)
DIN25: U1.D1(IO_L17N_7) U17.35(2A2)
DIN26: U1.E2(IO_L20P_7) U17.33(2A3)
DIN27: U1.E1(IO_L20N_7) U17.32(2A4)
DIN28: U1.F2(IO_L22N_7) U17.30(2A5)
DIN29: U1.G2(IO) U17.29(2A6)
DIN30: U1.G1(IO_L40P_7) U17.27(2A7)
DIN31: U1.H1(IO_L40N_7/VREF_7) U17.26(2A8)
DOUT0: U1.J1(IO_L40P_6/VREF_6) U10.47(1A1)
DOUT1: U1.J2(IO_L40N_6) U10.46(1A2)
DOUT2: U1.K1(IO) U10.44(1A3)
DOUT3: U1.K2(IO_L24P_6) U10.43(1A4)
DOUT4: U1.L2(IO_L22P_6) U10.41(1A5)
DOUT5: U1.M1(IO_L20P_6) U10.40(1A6)
DOUT6: U1.M2(IO_L20N_6) U10.38(1A7)
DOUT7: U1.N1(IO_L17P_6/VREF_6) U10.37(1A8)
DOUT8: U1.P1(IO_L01P_6/VRN_6) U10.36(2A1)
DOUT9: U1.R1(IO_L01N_6/VRP_6) U10.35(2A2)
DOUT10: U1.K3(IO_L24N_6/VREF_6) U10.33(2A3)
DOUT11: U1.L3(IO_L22N_6) U10.32(2A4)
DOUT12: U1.M3(IO_L19P_6) U10.30(2A5)
DOUT13: U1.N3(IO_L16P_6) U10.29(2A6)
DOUT14: U1.N2(IO_L17N_6) U10.27(2A7)
DOUT15: U1.P2(IO_L16N_6) U10.26(2A8)
DOUT16: U1.R3(IO_L01P_5/CS_B) U16.47(1A1)
DOUT17: U1.T3(IO_L01N_5/RDWR_B) U16.46(1A2)
DOUT18: U1.R4(IO_L10P_5/VRN_5) U16.44(1A3)
DOUT19: U1.T4(IO_L10N_5/VRP_5) U16.43(1A4)
DOUT20: U1.R5(IO_L27N_5/VREF_5) U16.41(1A5)
DOUT21: U1.T5(IO) U16.40(1A6)
DOUT22: U1.R6(IO_L29N_5) U16.38(1A7)
DOUT23: U1.R7(IO_L31P_5/D5) U16.37(1A8)
DOUT24: U1.T7(IO_L31N_5/D4) U16.36(2A1)
DOUT25: U1.N5(IO) U16.35(2A2)
DOUT26: U1.P5(IO_L27P_5) U16.33(2A3)
DOUT27: U1.N6(IO_L28N_5/D6) U16.32(2A4)
DOUT28: U1.P6(IO_L29P_5/VREF_5) U16.30(2A5)
DOUT29: U1.P7(IO) U16.29(2A6)
DOUT30: U1.N7(IO_L30N_5) U16.27(2A7)
DOUT31: U1.P8(IO_L32N_5/GCLK3) U16.26(2A8)
IORX+: U1.A8(IO_L32P_0/GCLK6) ; port IORX+
IORX-: U1.B8(IO_L32N_0/GCLK7) ; port IORX-
NetJP1_1: JP1.1 U10.2(1B1)
NetJP1_3: JP1.3 U10.3(1B2)
NetJP1_5: JP1.5 U10.5(1B3)
NetJP1_7: JP1.7 U10.6(1B4)
NetJP1_9: JP1.9 U10.8(1B5)
NetJP1_11: JP1.11 U10.9(1B6)
NetJP1_13: JP1.13 U10.11(1B7)
NetJP1_15: JP1.15 U10.12(1B8)
NetJP2_1: JP2.1 U11.2(1B1)
NetJP2_3: JP2.3 U11.3(1B2)
NetJP2_5: JP2.5 U11.5(1B3)
NetJP2_7: JP2.7 U11.6(1B4)
NetJP2_9: JP2.9 U11.8(1B5)
NetJP2_11: JP2.11 U11.9(1B6)
NetJP2_13: JP2.13 U11.11(1B7)
NetJP2_15: JP2.15 U11.12(1B8)
NetJP3_1: JP3.1 U10.13(2B1)
NetJP3_3: JP3.3 U10.14(2B2)
NetJP3_5: JP3.5 U10.16(2B3)
NetJP3_7: JP3.7 U10.17(2B4)
NetJP3_9: JP3.9 U10.19(2B5)
NetJP3_11: JP3.11 U10.20(2B6)
NetJP3_13: JP3.13 U10.22(2B7)
NetJP3_15: JP3.15 U10.23(2B8)
NetJP4_1: JP4.1 U11.13(2B1)
NetJP4_3: JP4.3 U11.14(2B2)
NetJP4_5: JP4.5 U11.16(2B3)
NetJP4_7: JP4.7 U11.17(2B4)
NetJP4_9: JP4.9 U11.19(2B5)
NetJP4_11: JP4.11 U11.20(2B6)
NetJP4_13: JP4.13 U11.22(2B7)
NetJP4_15: JP4.15 U11.23(2B8)
NetJP5_1: JP5.1 U16.2(1B1)
NetJP5_3: JP5.3 U16.3(1B2)
NetJP5_5: JP5.5 U16.5(1B3)
NetJP5_7: JP5.7 U16.6(1B4)
NetJP5_9: JP5.9 U16.8(1B5)
NetJP5_11: JP5.11 U16.9(1B6)
NetJP5_13: JP5.13 U16.11(1B7)
NetJP5_15: JP5.15 U16.12(1B8)
NetJP6_1: JP6.1 U17.2(1B1)
NetJP6_3: JP6.3 U17.3(1B2)
NetJP6_5: JP6.5 U17.5(1B3)
NetJP6_7: JP6.7 U17.6(1B4)
NetJP6_9: JP6.9 U17.8(1B5)
NetJP6_11: JP6.11 U17.9(1B6)
NetJP6_13: JP6.13 U17.11(1B7)
NetJP6_15: JP6.15 U17.12(1B8)
NetJP7_1: JP7.1 U16.13(2B1)
NetJP7_3: JP7.3 U16.14(2B2)
NetJP7_5: JP7.5 U16.16(2B3)
NetJP7_7: JP7.7 U16.17(2B4)
NetJP7_9: JP7.9 U16.19(2B5)
NetJP7_11: JP7.11 U16.20(2B6)
NetJP7_13: JP7.13 U16.22(2B7)
NetJP7_15: JP7.15 U16.23(2B8)
NetJP8_1: JP8.1 U17.13(2B1)
NetJP8_3: JP8.3 U17.14(2B2)
NetJP8_5: JP8.5 U17.16(2B3)
NetJP8_7: JP8.7 U17.17(2B4)
NetJP8_9: JP8.9 U17.19(2B5)
NetJP8_11: JP8.11 U17.20(2B6)
NetJP8_13: JP8.13 U17.22(2B7)
NetJP8_15: JP8.15 U17.23(2B8)

Not connected (* = marked no-connect by the designer): U1 C3(IO_L16P_7/VREF_7) C8(IO_L31P_0/VREF_0) E3(IO_L19N_7/VREF_7) E4(IO_L21P_7) E6(IO_L27N_0) F5(IO_L23P_7) G5(IO_L23N_7) H3(IO_L39N_7) H4(IO_L39P_7) J3(IO_L39P_6) J4(IO_L39N_6) K4(IO_L23P_6) K5(IO_L23N_6) L4(IO_L21P_6) L5(IO_L21N_6) M4(IO_L19N_6) M6(IO_L28P_5/D7) M7(IO_L30P_5) N8(IO_L32P_5/GCLK2) T8(IO/VREF_5)

### Notes on the sheet
- Title:
- Engineer:
- Date:
- Revision:
- Sheet
- of
- File:

### Library data of the parts
C20 C22 C25 C26 C29 C30 C33 C34 = POLCAP: Standard Capacitor; Type: Tantalum
C23 C24 C27 C28 C31 C32 C35 C36 = CAPACITOR: Standard Capacitor; Type: X7R
JP1-JP8 = Header 8X2: Header, 8-Pin, Dual row; Manufacturer: Generic Components; Class I: Connector; Revision: July-2002: Re-released for DXP Platform.; Publisher: Altium Limited
U1 = XC3S200-FT256: Xilinx Spartan-3 FPGA
U10 U11 U16 U17 = SN74LVCH16245ADGGR: 16-bit bus transceiver with 3-state outputs

## Nets that join several sheets
+2.5VCC: power (19 pins), DIO (36 pins)
+5VCC: F/A1 (C10.A1.1 C12.A1.1 U7.A1.20), F/A2 (C10.A2.1 C12.A2.1 U7.A2.20), power (L1.1 P17.2 P17.4 P17.6), DIO (16 pins)
AVDD: F/A1 (13 pins), F/A2 (13 pins), power (C64.1 C65.1 L1.2)
GND: FPGA (DS1.2 DS2.2), F/A1 (43 pins), F/A2 (43 pins), power (89 pins), SERIALIO (12 pins), DIO (120 pins)
VCC: FPGA (6 pins), F/A1 (10 pins), F/A2 (10 pins), power (32 pins), SERIALIO (13 pins)
IORX+: SERIALIO (J1.6), DIO (U1.A8)
IORX-: SERIALIO (J1.5), DIO (U1.B8)
NetU1_C15: FPGA (U1.C15), F/A1 (U7.A1.23)
NetU1_C16: FPGA (U1.C16), F/A1 (U7.A1.25)
NetU1_D15: FPGA (U1.D15), F/A1 (U7.A1.27)
NetU1_D16: FPGA (U1.D16), F/A1 (U7.A1.28)
NetU1_E13: FPGA (U1.E13), F/A1 (U6.A1.10 U7.A1.26 U9.A1.10)
NetU1_E14: FPGA (U1.E14), F/A1 (U6.A1.9 U9.A1.9)
NetU1_E15: FPGA (U1.E15), F/A1 (U6.A1.11 U9.A1.11)
NetU1_K15: FPGA (U1.K15), F/A2 (U6.A2.10 U7.A2.26 U9.A2.10)
NetU1_K16: FPGA (U1.K16), F/A2 (U6.A2.9 U9.A2.9)
NetU1_L12: FPGA (U1.L12), F/A2 (U6.A2.11 U9.A2.11)
NetU1_M15: FPGA (U1.M15), F/A2 (U7.A2.23)
NetU1_M16: FPGA (U1.M16), F/A2 (U7.A2.25)
NetU1_N15: FPGA (U1.N15), F/A2 (U7.A2.27)
NetU1_N16: FPGA (U1.N16), F/A2 (U7.A2.28)